# Altium project PCB_Project1.PrjPCB
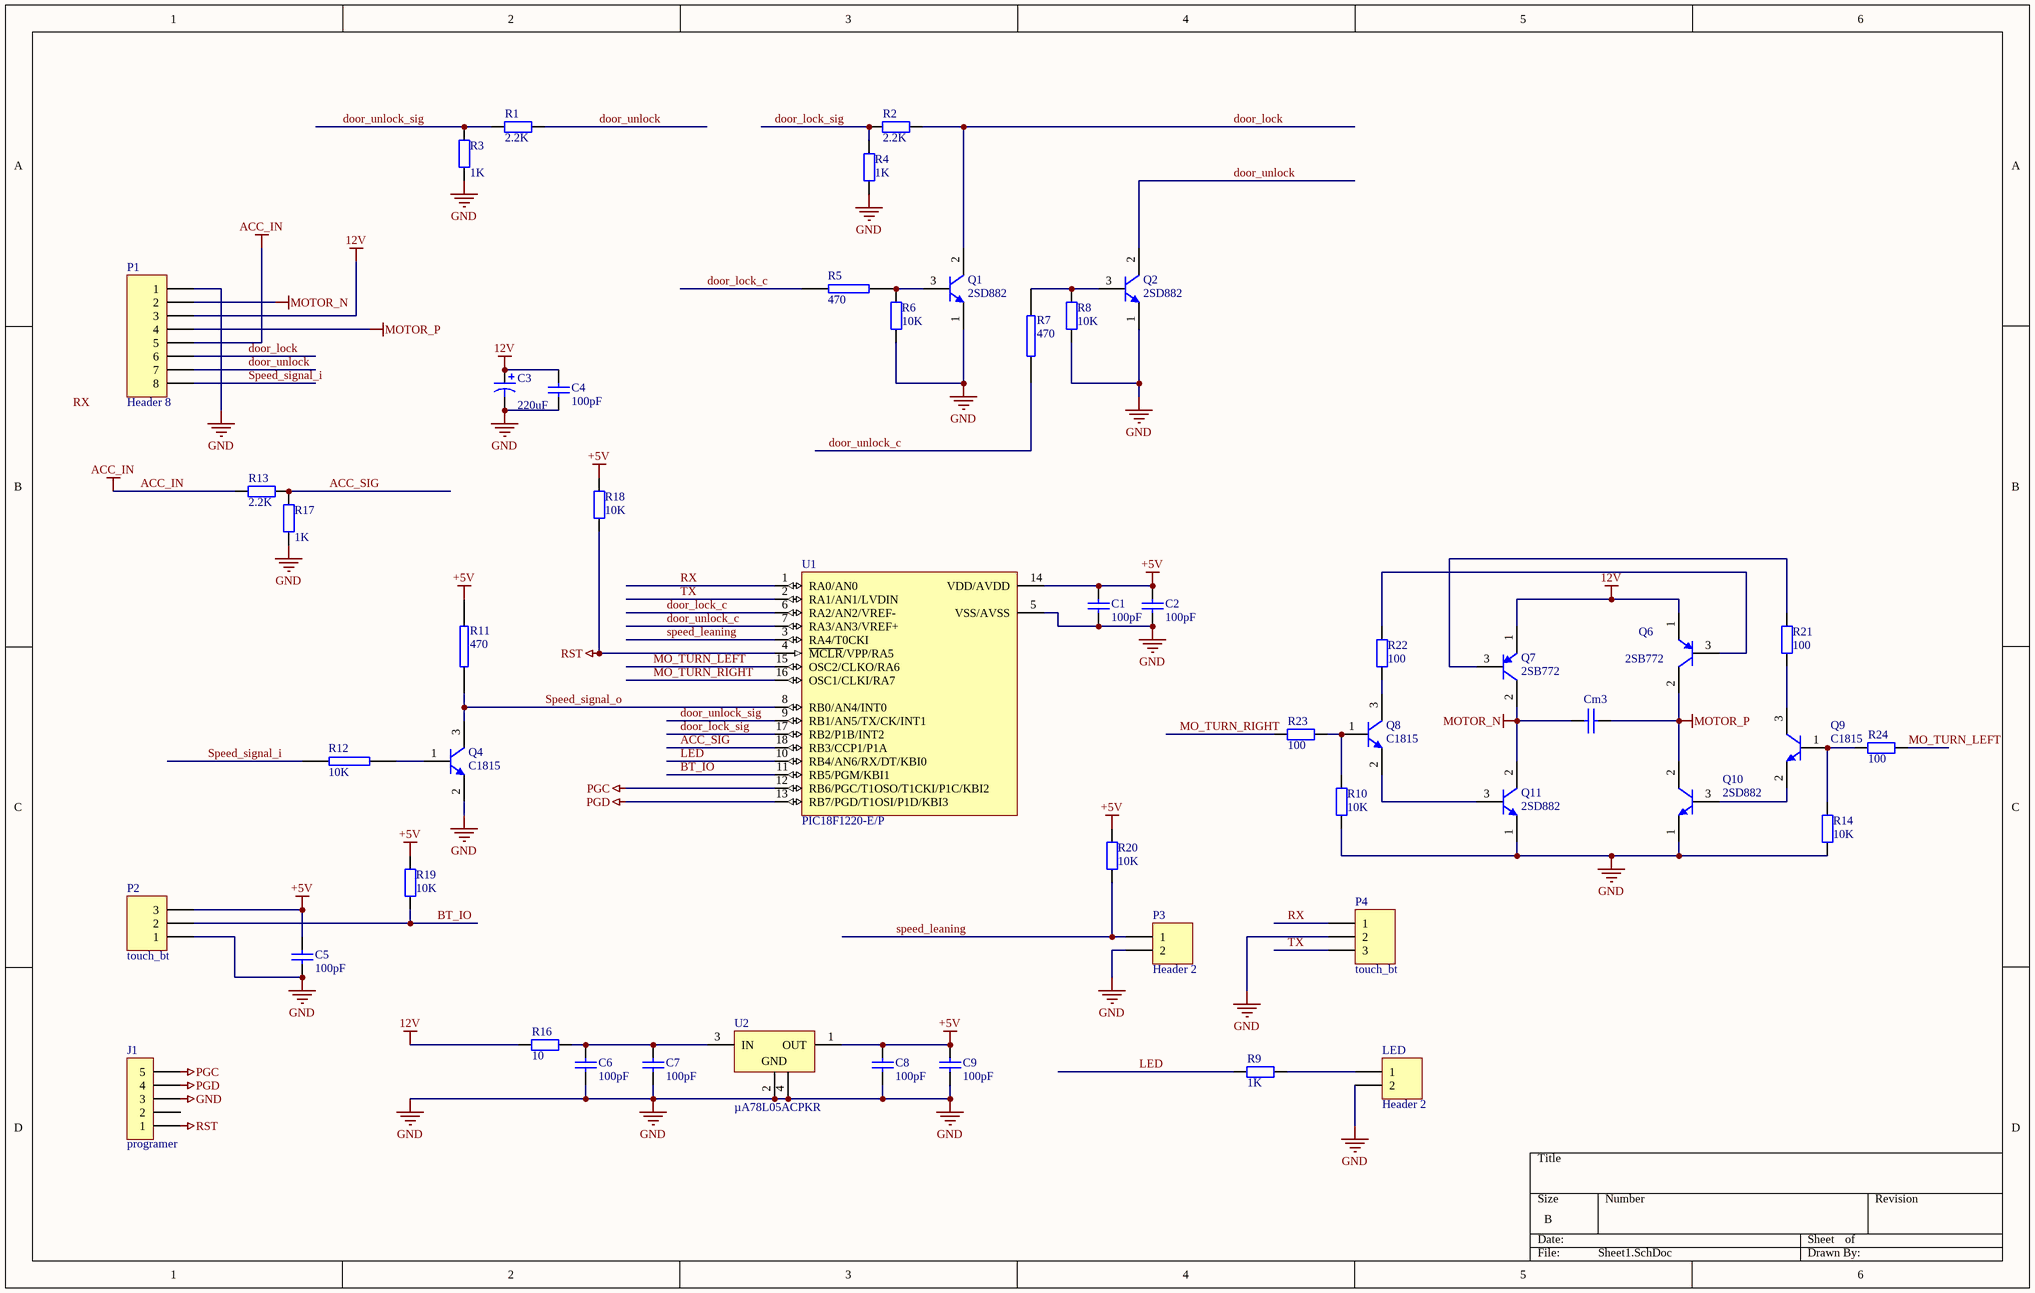
[diagram p0: Sheet1.SchDoc]
1 sheet, 50 parts. Net scope: global (net labels, ports and power ports of the same name join across sheets).
Board file: PCB2.PcbDoc

## Sheet Sheet1.SchDoc
size B

### Parts
C1  value 100pF  [RESC2012L]  (hidden comment: Cap Semi)
C2  value 100pF  [RESC2012L]  (hidden comment: Cap Semi)
C3  value 220uF  [CAPU150-175K]  (hidden comment: Cap Pol3)
C4  value 100pF  [RESC2012L]  (hidden comment: Cap Semi)
C5  value 100pF  [RESC2012L]  (hidden comment: Cap Semi)
C6  value 100pF  [RESC2012L]  (hidden comment: Cap Semi)
C7  value 100pF  [RESC2012L]  (hidden comment: Cap Semi)
C8  value 100pF  [RESC2012L]  (hidden comment: Cap Semi)
C9  value 100pF  [RESC2012L]  (hidden comment: Cap Semi)
Cm3  (no value)  [1206]
J1  programer  [HDR1x5]
LED  Header 2  [HDR1X2]
P1  Header 8  [P8_150]
P2  touch_bt  [HDR1X3]
P3  Header 2  [HDR1X2]
P4  touch_bt  [HDR1X3]
Q1  2SD882  [ONSC-TO-225-3-77-09]
Q2  2SD882  [ONSC-TO-225-3-77-09]
Q4  C1815  [ONSC-CPA-3_V]
Q6  2SB772  [ONSC-TO-225-3-77-09]
Q7  2SB772  [ONSC-TO-225-3-77-09]
Q8  C1815  [ONSC-CPA-3_V]
Q9  C1815  [ONSC-CPA-3_V]
Q10  2SD882  [ONSC-TO-225-3-77-09]
Q11  2SD882  [ONSC-TO-225-3-77-09]
R1  value 2.2K  [RESC2012L]  (hidden comment: Res2)
R2  value 2.2K  [RESC2012L]  (hidden comment: Res2)
R3  value 1K  [RESC2012L]  (hidden comment: Res2)
R4  value 1K  [RESC2012L]  (hidden comment: Res2)
R5  470  [RESC2012L]
R6  value 10K  [RESC2012L]  (hidden comment: Res2)
R7  470  [RESC2012L]
R8  value 10K  [RESC2012L]  (hidden comment: Res2)
R9  value 1K  [RESC2012L]  (hidden comment: Res2)
R10  value 10K  [RESC2012L]  (hidden comment: Res2)
R11  470  [RESC2012L]
R12  10K  [RESC2012L]
R13  value 2.2K  [RESC2012L]  (hidden comment: Res2)
R14  value 10K  [RESC2012L]  (hidden comment: Res2)
R16  value 10  [1206]  (hidden comment: Res2)
R17  value 1K  [RESC2012L]  (hidden comment: Res2)
R18  value 10K  [RESC2012L]  (hidden comment: Res2)
R19  value 10K  [RESC2012L]  (hidden comment: Res2)
R20  value 10K  [RESC2012L]  (hidden comment: Res2)
R21  value 100  [RESC2012L]  (hidden comment: Res2)
R22  value 100  [RESC2012L]  (hidden comment: Res2)
R23  value 100  [RESC2012L]  (hidden comment: Res2)
R24  value 100  [RESC2012L]  (hidden comment: Res2)
U1  PIC18F1220-E/P  [PDIP300-P18]
U2  µA78L05ACPKR  [PK03]

### Nets
12V: C3.1 C4.2 P1.3 Q6.1(E) Q7.1(E) R16.2
+5V: C1.2 C2.2 C5.2 C8.2 C9.2 P2.3 R11.1 R18.1 R19.1 R20.1 U1.14(VDD/AVDD) U2.1(OUT)
ACC_IN: P1.5 R13.2
GND: C1.1 C2.1 C3.2 C4.1 C5.1 C6.1 C7.1 C8.1 C9.1 J1.3 LED.2 P1.1 P2.1 P3.2 P4.2 Q1.1(E) Q2.1(E) Q4.2(E) Q10.1(E) Q11.1(E) R3.1 R4.2 R6.2 R8.2 R10.2 R14.2 R17.1 U1.5(VSS/AVSS) U2.2(GND) U2.4(GND)
MOTOR_N: Cm3.1 P1.2 Q7.2(C) Q11.2(C)
MOTOR_P: Cm3.2 P1.4 Q6.2(C) Q10.2(C)
PGC: J1.5 U1.12(RB6/PGC/T1OSO/T1CKI/P1C/KBI2)
PGD: J1.4 U1.13(RB7/PGD/T1OSI/P1D/KBI3)
RST: J1.1 R18.2 U1.4(~{MCLR}/VPP/RA5)
ACC_SIG: R13.1 R17.2 U1.18(RB3/CCP1/P1A)
BT_IO: P2.2 R19.2 U1.11(RB5/PGM/KBI1)
door_lock: P1.6 Q1.2(C) R2.1
door_lock_c: R5.1 U1.6(RA2/AN2/VREF-)
door_lock_sig: R2.2 R4.1 U1.17(RB2/P1B/INT2)
door_unlock: P1.7 Q2.2(C) R1.1
door_unlock_c: R7.2 U1.7(RA3/AN3/VREF+)
door_unlock_sig: R1.2 R3.2 U1.9(RB1/AN5/TX/CK/INT1)
LED: R9.2 U1.10(RB4/AN6/RX/DT/KBI0)
MO_TURN_LEFT: R24.2 U1.15(OSC2/CLKO/RA6)
MO_TURN_RIGHT: R23.1 U1.16(OSC1/CLKI/RA7)
RX: P4.1 U1.1(RA0/AN0)
speed_leaning: P3.1 R20.2 U1.3(RA4/T0CKI)
Speed_signal_i: P1.8 R12.1
Speed_signal_o: Q4.3(C) R11.2 U1.8(RB0/AN4/INT0)
TX: P4.3 U1.2(RA1/AN1/LVDIN)
NetC6_2: C6.2 C7.2 R16.1 U2.3(IN)
NetLED_1: LED.1 R9.1
NetQ1_3: Q1.3(B) R5.2 R6.1
NetQ2_3: Q2.3(B) R7.1 R8.1
NetQ4_1: Q4.1(B) R12.2
NetQ6_3: Q6.3(B) R22.1
NetQ7_3: Q7.3(B) R21.1
NetQ8_1: Q8.1(B) R10.1 R23.2
NetQ8_2: Q8.2(E) Q11.3(B)
NetQ8_3: Q8.3(C) R22.2
NetQ9_1: Q9.1(B) R14.1 R24.1
NetQ9_2: Q9.2(E) Q10.3(B)
NetQ9_3: Q9.3(C) R21.2

Not connected (* = marked no-connect by the designer): J1 2

### Notes on the sheet
- Labels drawn without touching a wire or pin: RX

### Library data of the parts
C1 C2 C4-C9 = Cap Semi: Capacitor (Semiconductor SIM Model); Published: 8-Jun-2000; LatestRevisionDate: 29-May-2009; LatestRevisionNote: IPC-7351 Footprint Added.; PackageReference: C1206; Publisher: Altium Limited; PackageDescription: Chip Capacitor
C3 = Cap Pol3: Polarized Capacitor (Surface Mount); Published: 8-Jun-2000; LatestRevisionDate: 29-May-2009; LatestRevisionNote: IPC-7351 Footprint Added.; PackageReference: C0805; Publisher: Altium Limited; PackageDescription: Chip Capacitor
Cm3 = CAP: Capacitor
J1 = CON5: Connector
LED P3 = Header 2: Header, 2-Pin; LatestRevisionDate: 17-Jul-2002; LatestRevisionNote: Re-released for DXP Platform.; Publisher: Altium Limited
P1 = Header 8: Header, 8-Pin; LatestRevisionDate: 17-Jul-2002; LatestRevisionNote: Re-released for DXP Platform.; Publisher: Altium Limited
P2 P4 = Header 3: Header, 3-Pin; LatestRevisionDate: 17-Jul-2002; LatestRevisionNote: Re-released for DXP Platform.; Publisher: Altium Limited
Q1 Q2 Q10 Q11 = MJE340: Plastic Medium-Power NPN Silicon Transistor, 3-Pin TO-225, Bulk Box; Manufacturer: On Semiconductor; Note: 0; IC Continuous (A): 0.5; DatasheetVersion: Rev. 12; PackageVersion: Rev. AC, 12/2013; PackageReference: TO-225-3-77-09; PackageDescription: 3-Pin Flange Mount, Vertical Straight Lead, Body 7.6 x 2.7 mm, Pitch 2.29 mm; Packing: Bulk Box; Polarity: NPN; RoHS: FALSE; Mounting Technology: Through Hole; PartNumber: MJE340; ComponentLink1Description: Manufacturer URL; ComponentLink1URL: http://www.onsemi.com/; ComponentLink2Description: Datasheet; ComponentLink2URL: http://www.onsemi.com/pub_link/Collateral/MJE340-D.PDF; ComponentLink3Description: Package Specification; ComponentLink3URL: http://www.onsemi.com/pub_link/Collateral/77-09.PDF
Q4 Q8 Q9 = 2SC2812N6-CPA-TB-E: Bipolar Transistor, 50 V, 150 mA, Low VCE(sat), NPN Single, 3-Pin CPA, Pb-Free, Tape and Reel; Manufacturer: On Semiconductor; IC Continuous (A): 0.15; PackageReference: CPA-3; PackageDescription: 3-Pin FM, Body 8.1 x 10 mm, Pitch 2.54 mm; Supplier 1: Digi-Key; Supplier Part Number 1: 2SC2812N6-CPA-TB-E-ND; Supplier 2: Newark; Supplier Part Number 2: 07W7646; Supplier 3: Mouser; Supplier Part Number 3: 863-2SC2812N6CPATB-E; Packing: Tape and Reel; Polarity: NPN; RoHS: TRUE; Mounting Technology: Surface Mount; PartNumber: 2SC2812N6-CPA-TB-E; ComponentLink1Description: Manufacturer URL; ComponentLink1URL: http://www.onsemi.com/; ComponentLink2Description: Datasheet; ComponentLink2URL: http://www.onsemi.com/pub_link/Collateral/EN7198-D.PDF; ComponentLink3Description: Package Specification; ComponentLink3URL: http://www.onsemi.com/pub_link/Collateral/EN7198-D.PDF
Q6 Q7 = MJE350: Plastic Medium-Power PNP Silicon Transistor, 3-Pin TO-225, Bulk Box; Manufacturer: On Semiconductor; Note: 0; IC Continuous (A): 0.5; DatasheetVersion: Rev. 16; PackageVersion: Rev. AC, 12/2013; PackageReference: TO-225-3-77-09; PackageDescription: 3-Pin Flange Mount, Vertical Straight Lead, Body 7.6 x 2.7 mm, Pitch 2.29 mm; Packing: Bulk Box; Polarity: PNP; RoHS: FALSE; Mounting Technology: Through Hole; PartNumber: MJE350; ComponentLink1Description: Manufacturer URL; ComponentLink1URL: http://www.onsemi.com/; ComponentLink2Description: Datasheet; ComponentLink2URL: http://www.onsemi.com/pub_link/Collateral/MJE350-D.PDF; ComponentLink3Description: Package Specification; ComponentLink3URL: http://www.onsemi.com/pub_link/Collateral/77-09.PDF
R1-R4 R6 R8-R10 R13 R14 R16-R24 = Res2: Resistor; Published: 8-Jun-2000; LatestRevisionDate: 17-Jul-2002; LatestRevisionNote: Re-released for DXP Platform.; PackageReference: AXIAL-0.4; Publisher: Altium Limited; PackageDescription: Axial Device, Thru-Hole; 2 Leads; 0.4 in Pin Spacing
R5 R7 R11 R12 = RES2
U1 = PIC18F1220-E/P: High Performance, Enhanced Flash Microcontroller with 10-Bit A/D and nanoWatt Technology, 4K Flash, 18-Pin PDIP, Extended Temperature; Published: 11-Oct-2004; LatestRevisionDate: 29-Jan-2009; LatestRevisionNote: Sch. layout revised. 3D Model Removed.; DatasheetVersion: revF, Feb-2007; PackageVersion: revBB, Aug-2009; PackageReference: PDIP300-P18; Publisher: Altium Limited; PackageDescription: 18-Lead Plastic Dual In-Line (P) - 300 mil Body [PDIP]; Supplier 1: Digi-Key; Supplier Part Number 1: PIC18F1220-E/P-ND; Supplier 2: Farnell; Supplier Part Number 2: 1579595; Code_JEDEC: MS-001; ComponentLink1Description: Datasheet; ComponentLink1URL: http://ww1.microchip.com/downloads/en/DeviceDoc/39605F.pdf; ComponentLink2Description: Packaging Specification; ComponentLink2URL: http://www.microchip.com/stellent/groups/techpub_sg/documents/packagingspec/en012702.pdf; ComponentLink3Description: Microchip.com Home; ComponentLink3URL: http://www.microchip.com/
U2 = µA78L05ACPKR: Positive-Voltage Regulator; Note: Pin 2 is electrically connected to TAB.; Published: 15-Apr-2002; DatasheetVersion: Jul-2000; PackageVersion: Oct-1994; PackageReference: PK03; Publisher: Altium Limited; PackageDescription: SOT-89; Body 4.6 x 4.25 mm, inc. leads (LxW max); Code_JEDEC: TO-243-AA; Code_IPC: SOT 89; ComponentLink1Description: Manufacturer Link; ComponentLink1URL: http://www.ti.com/; ComponentLink2Description: Datasheet; ComponentLink2URL: http://www-s.ti.com/sc/ds/ua78l05a.pdf